# Altium schematic sheet TPS7A9101DSKT.SchDoc
size A
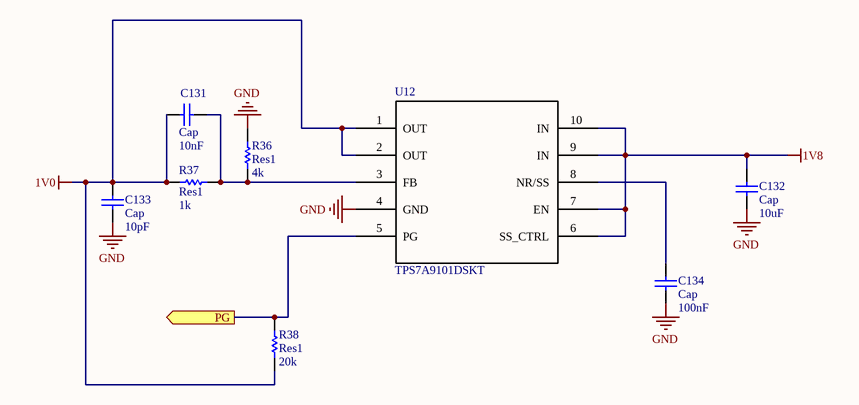
[diagram p0: TPS7A9101DSKT.SchDoc]

## Parts
C131  Cap  value 10nF  [0402-A]
C132  Cap  value 10uF  [C1206]
C133  Cap  value 10pF  [0402-A]
C134  Cap  value 100nF  [0402-A]
R36  Res1  value 4k  [0402-A]
R37  Res1  value 1k  [0402-A]
R38  Res1  value 20k  [0402-A]
U12  TPS7A9101DSKT  [TPS7A9101DSKT]

## Ports
PG (out)

## Nets
1V0: C131.1 C133.1 R37.1 R38.1 U12.1(OUT) U12.2(OUT)
1V8: C132.2 U12.6(SS_CTRL) U12.7(EN) U12.9(IN) U12.10(IN)
GND: C132.1 C133.2 C134.1 R36.2 U12.4(GND)
PG: R38.2 U12.5(PG) ; port PG
NetC131_2: C131.2 R36.1 R37.2 U12.3(FB)
NetC134_2: C134.2 U12.8(NR/SS)

## Library data of the parts
C131-C134 = Cap: Capacitor; Published: 8-Jun-2000; LatestRevisionDate: 17-Jul-2002; LatestRevisionNote: Re-released for DXP Platform.; PackageReference: RAD-0.3; Publisher: Altium Limited; PackageDescription: Radial Cap, Thru-Hole; 2 Leads; 0.3 in Pin Spacing
R36-R38 = Res1: Resistor; Published: 8-Jun-2000; LatestRevisionDate: 17-Jul-2002; LatestRevisionNote: Re-released for DXP Platform.; PackageReference: AXIAL-0.3; Publisher: Altium Limited; PackageDescription: Axial Device, Thru-Hole; 2 Leads; 0.3 in Pin Spacing